# EAGLE design psu (EAGLE 6.5.0)
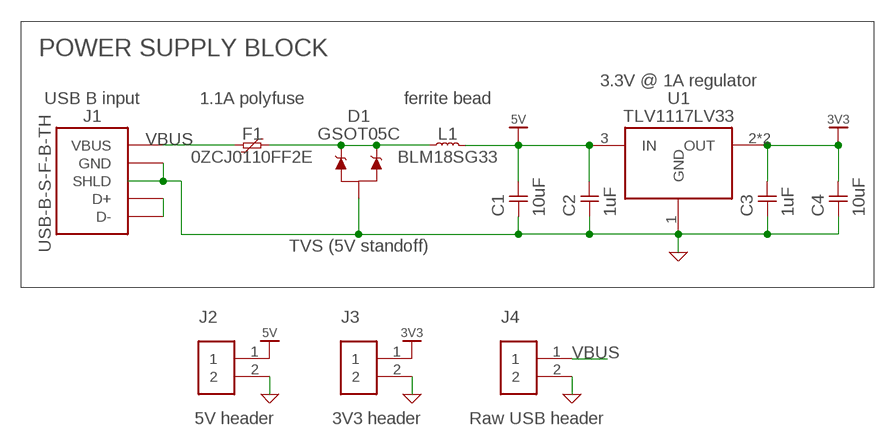
[diagram p0: schematic, sheet 1]

## Parts
C1  10uF  C0805  [0805]
C2  1uF  C0603  [0603]
C3  1uF  C0603  [0603]
C4  10uF  C0805  [0805]
D1  GSOT05C  [SOT23-3]
F1  0ZCJ0110FF2E  POLYFUSE-1206  [1206]
J1  USB-B-S-F-B-TH  USB-B-SAMTEC  [USB-B-SAMTEC]
J2  HEADER_100MIL_1ROW_2  [HEADER_100MIL_1ROW_2]
J3  HEADER_100MIL_1ROW_2  [HEADER_100MIL_1ROW_2]
J4  HEADER_100MIL_1ROW_2  [HEADER_100MIL_1ROW_2]
L1  BLM18SG33  FERRITE_BEAD-0603  [0603]
U1  TLV1117LV33  TLV1117LV33DCY  [SOT223-3]

## Nets
3V3: C3.1 C4.1 J3.1 U1.2(OUT) U1.4(OUT)
5V: C1.1 C2.1 J2.1 L1.2 U1.3(IN)
GND: C1.2 C2.2 C3.2 C4.2 D1.3(A) J1.4(GND) J1.5(SHLD) J1.6(SHLD) J2.2 J3.2 J4.2 U1.1(GND) ; supply symbol labelled DGND
N$10: J1.2(D-) J1.3(D+)
N$12: D1.1(C1) D1.2(C2) F1.2 L1.1
VBUS: F1.1 J1.1(VBUS) J4.1

## Notes on the sheet
- POWER SUPPLY BLOCK
- 3.3V @ 1A regulator
- USB B input | 1.1A polyfuse | ferrite bead
- TVS (5V standoff)
- 5V header | 3V3 header | Raw USB header

## Library data of the parts
C1-C4 = sjunglib:C: Capacitor
D1 = sjunglib:GSOT05C: GSOTxxC dual TVS diodes (common anode) Manufacturer: Vishay Peak pulse current: 30A each Reverse standoff voltage: 3.3V, 4V, 5V, 8V, 12V, 15V, 24V, 36V
F1 = sjunglib:POLYFUSE: Polyfuse
J1 = sjunglib:USB-B: USB B jack Manufacturer: On-Shore Technologies Part number: USB-B1HSB6 Manufacturer: Samtec Part number: USB-B-S-X-X-TH-X-XX
J2-J4 = sjunglib:HEADER_100MIL_1ROW_2: 0.1" header single-row x2
L1 = sjunglib:FERRITE_BEAD: Ferrite bead
U1 = sjunglib:TLV1117LV33: TLV1117LV33 3.3V LDO regulator Manufacturer: TI Output: 3.3V @ 1A Dropout: 455mV @ 1A Input: Up to 5.5V Max quiescent current: 100uA Stable with ceramic output caps Stable with 0mA load current

## Board
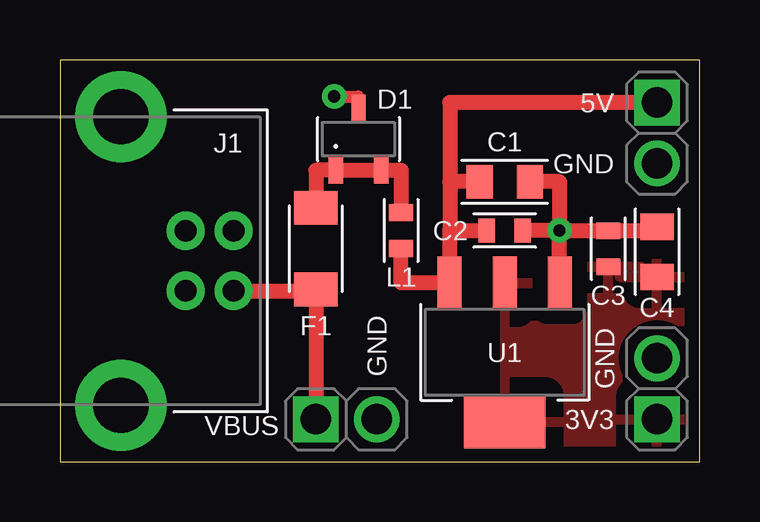
[diagram p1: board, top side]
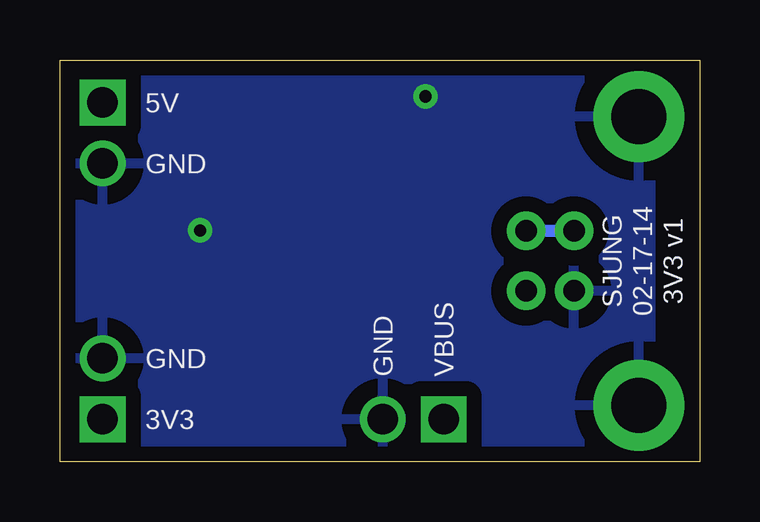
[diagram p2: board, bottom side, seen from below]

Size 26.67 x 16.76 mm. Coordinates in mm from the lower left corner, seen from the top.
Outline: 0,0 26.67,0 26.67,16.76 0,16.76 0,0
Copper layers (1*16): Top 0.035mm / dielectric 1.5mm / Bottom 0.035mm
Design rules "SeeedStudio_DRU_no_angle_2layer *": minimum track width 8mil, minimum drill 15mil, track to track 10mil, track to pad 10mil, pad to pad 10mil, via to via 10mil, smd to smd 0mil, copper to edge 15mil, drill to drill 15mil, minimum pad ring 10mil, minimum via ring 6mil, stop-mask expansion 2mil, vias tented up to drill 25mil, thermal gap 30mil

### Footprints (pad centres in the part's own frame; a part is rotated, then mirrored left to right if it is on the bottom)
0805 = smd 1.1 x 1.4: 1 -1.05,0; 2 1.05,0
0603 = smd 0.7 x 1: 1 -0.75,0; 2 0.75,0
SOT23-3 = smd 1.1 x 0.6: 1 -1.3,0.95; 2 -1.3,-0.95; 3 1.3,0
1206 = smd 1.4 x 1.8: 1 -1.7,0; 2 1.7,0
USB-B-SAMTEC = drill 0.9 pad 1.6: 1 1.25,4.7; 2 -1.25,4.7; 3 -1.25,2.7; 4 1.25,2.7 | drill 2.3 pad 3.8: 5 -6.02,0; 6 6.02,0
HEADER_100MIL_1ROW_2 = drill 1.27 pad 1.905 square: 1 -1.27,0 | drill 1.27 pad 1.905: 2 1.27,0
SOT223-3 = smd 2.2 x 1: 1 -2.9,2.3; 2 -2.9,0; 3 -2.9,-2.3 | smd 2.2 x 3.4: 4 2.9,0

### Placement (x,y rotation side)
C1  18.54,11.68 0 top
C2  18.54,9.65 0 top
C3  22.86,8.89 90 top
C4  24.89,8.76 90 top
D1  12.45,13.46 90 top
F1  10.67,8.89 90 top
J1  2.54,8.38 270 top
J2  24.89,13.72 270 top
J3  24.89,3.05 90 top
J4  11.94,1.78 0 top
L1  14.22,9.65 270 top
U1  18.54,4.57 270 top

### Tracks (layer width: path | path; a pad name or v marks a point on that pad's centre or on a via)
3V3
  pour Top (isolate 0.635): 26.67,0 26.67,8.26 18.54,8.26 18.54,0
5V
  Top 0.508: U1.3 16.26,7.47 | C1.1 17.27,11.68
  Top 0.635: 16.26,7.47 16.26,9.65 | 16.26,9.65 C2.1 | 16.26,11.68 16.26,9.65 | C1.1 16.26,11.68 | J2.1 16.26,14.99 16.26,11.68 | U1.3 14.22,7.47 L1.2
GND  (via drill 0.51 pad 1.02)
  Top 0.406: U1.1 20.83,7.47
  Top 0.508: v11.43,15.24 12.45,15.24 D1.3
  Top 0.635: 20.83,7.47 v20.83,9.65 | v20.83,9.65 C2.2 | C1.2 20.83,11.68 v20.83,9.65 | v20.83,9.65 22.86,9.65 C3.2 24.89,9.64 C4.2 24.89,9.65
  pour Bottom (isolate 0.635): 2.03,16.76 26.67,16.76 26.67,0 2.03,0
N$10
  Bottom 0.508: J1.3 J1.2
N$12
  Top 0.635: 10.8,10.59 F1.2 10.67,12.16 D1.1 D1.2 14.22,12.16 L1.1
VBUS
  Top 0.635: J1.1 10.67,7.13 | 10.67,7.13 F1.1 | 10.67,7.13 J4.1

### Text on the board
tPlace: 5V | GND | GND | GND | VBUS | 3V3
bPlace: 5V | GND | 3V3 v1 | 02-17-14 | SJUNG | VBUS | GND | GND | 3V3